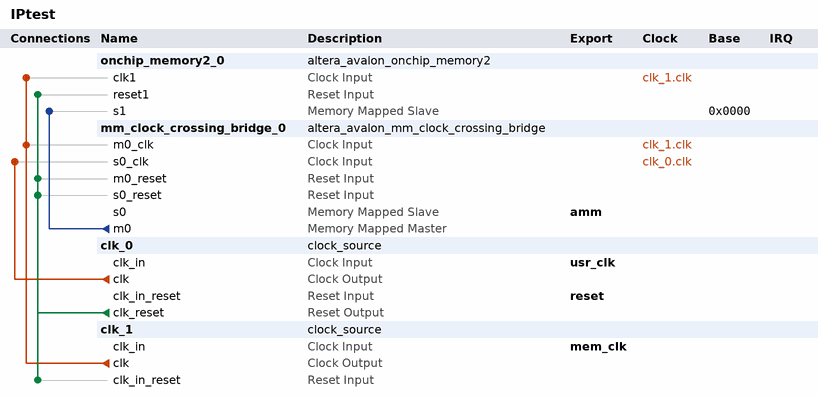
[diagram p0: system contents]
# Platform Designer (Qsys) system IPtest, Cyclone V 5CEBA2F17A7
# Parameters at their usual value, and those the tool derives, are not listed.
package require -exact qsys 17.0
create_system IPtest
set_project_property DEVICE_FAMILY {Cyclone V}
set_project_property DEVICE 5CEBA2F17A7

add_instance onchip_memory2_0 altera_avalon_onchip_memory2 17.0
set_instance_parameter_value onchip_memory2_0 dataWidth 64
set_instance_parameter_value onchip_memory2_0 dualPort false
set_instance_parameter_value onchip_memory2_0 initMemContent false
set_instance_parameter_value onchip_memory2_0 initializationFileName onchip_mem.hex
set_instance_parameter_value onchip_memory2_0 memorySize 67108864
set_instance_parameter_value onchip_memory2_0 resetrequest_enabled false

add_instance mm_clock_crossing_bridge_0 altera_avalon_mm_clock_crossing_bridge 17.0
set_instance_parameter_value mm_clock_crossing_bridge_0 ADDRESS_UNITS WORDS
set_instance_parameter_value mm_clock_crossing_bridge_0 ADDRESS_WIDTH 32
set_instance_parameter_value mm_clock_crossing_bridge_0 COMMAND_FIFO_DEPTH 8
set_instance_parameter_value mm_clock_crossing_bridge_0 DATA_WIDTH 64
set_instance_parameter_value mm_clock_crossing_bridge_0 MASTER_SYNC_DEPTH 2
set_instance_parameter_value mm_clock_crossing_bridge_0 MAX_BURST_SIZE 1
set_instance_parameter_value mm_clock_crossing_bridge_0 RESPONSE_FIFO_DEPTH 8
set_instance_parameter_value mm_clock_crossing_bridge_0 SLAVE_SYNC_DEPTH 2
set_instance_parameter_value mm_clock_crossing_bridge_0 USE_AUTO_ADDRESS_WIDTH 0

add_instance clk_0 clock_source 17.0
set_instance_parameter_value clk_0 clockFrequency 250000000

add_instance clk_1 clock_source 17.0
set_instance_parameter_value clk_1 clockFrequency 300000000

# connections
add_connection clk_0.clk mm_clock_crossing_bridge_0.s0_clk clock
add_connection clk_1.clk mm_clock_crossing_bridge_0.m0_clk clock
add_connection clk_1.clk onchip_memory2_0.clk1 clock
add_connection clk_0.clk_reset clk_1.clk_in_reset reset
add_connection clk_0.clk_reset mm_clock_crossing_bridge_0.m0_reset reset
add_connection clk_0.clk_reset mm_clock_crossing_bridge_0.s0_reset reset
add_connection clk_0.clk_reset onchip_memory2_0.reset1 reset
add_connection mm_clock_crossing_bridge_0.m0 onchip_memory2_0.s1 avalon
set_connection_parameter_value mm_clock_crossing_bridge_0.m0/onchip_memory2_0.s1 baseAddress 0x0000

# exported interfaces
add_interface amm avalon slave
set_interface_property amm EXPORT_OF mm_clock_crossing_bridge_0.s0
add_interface mem_clk clock sink
set_interface_property mem_clk EXPORT_OF clk_1.clk_in
add_interface reset reset sink
set_interface_property reset EXPORT_OF clk_0.clk_in_reset
add_interface usr_clk clock sink
set_interface_property usr_clk EXPORT_OF clk_0.clk_in

set_interconnect_requirement {$system} qsys_mm.clockCrossingAdapter HANDSHAKE
set_interconnect_requirement {$system} qsys_mm.enableEccProtection FALSE
set_interconnect_requirement {$system} qsys_mm.insertDefaultSlave FALSE
set_interconnect_requirement {$system} qsys_mm.maxAdditionalLatency 1

save_system IPtest.qsys
